# Altium schematic sheet RXMIX.SchDoc
size Legal; CompanyName: Brinton Engineering, LLC; Address1: 3479 Edison Way; Address2: Menlo Park CA 94025; Address3: +1 (877) 778-8435; Address4: brintonengineering.com; DocumentNumber: 48; Revision: 1; SheetNumber: 48; SheetTotal: 50
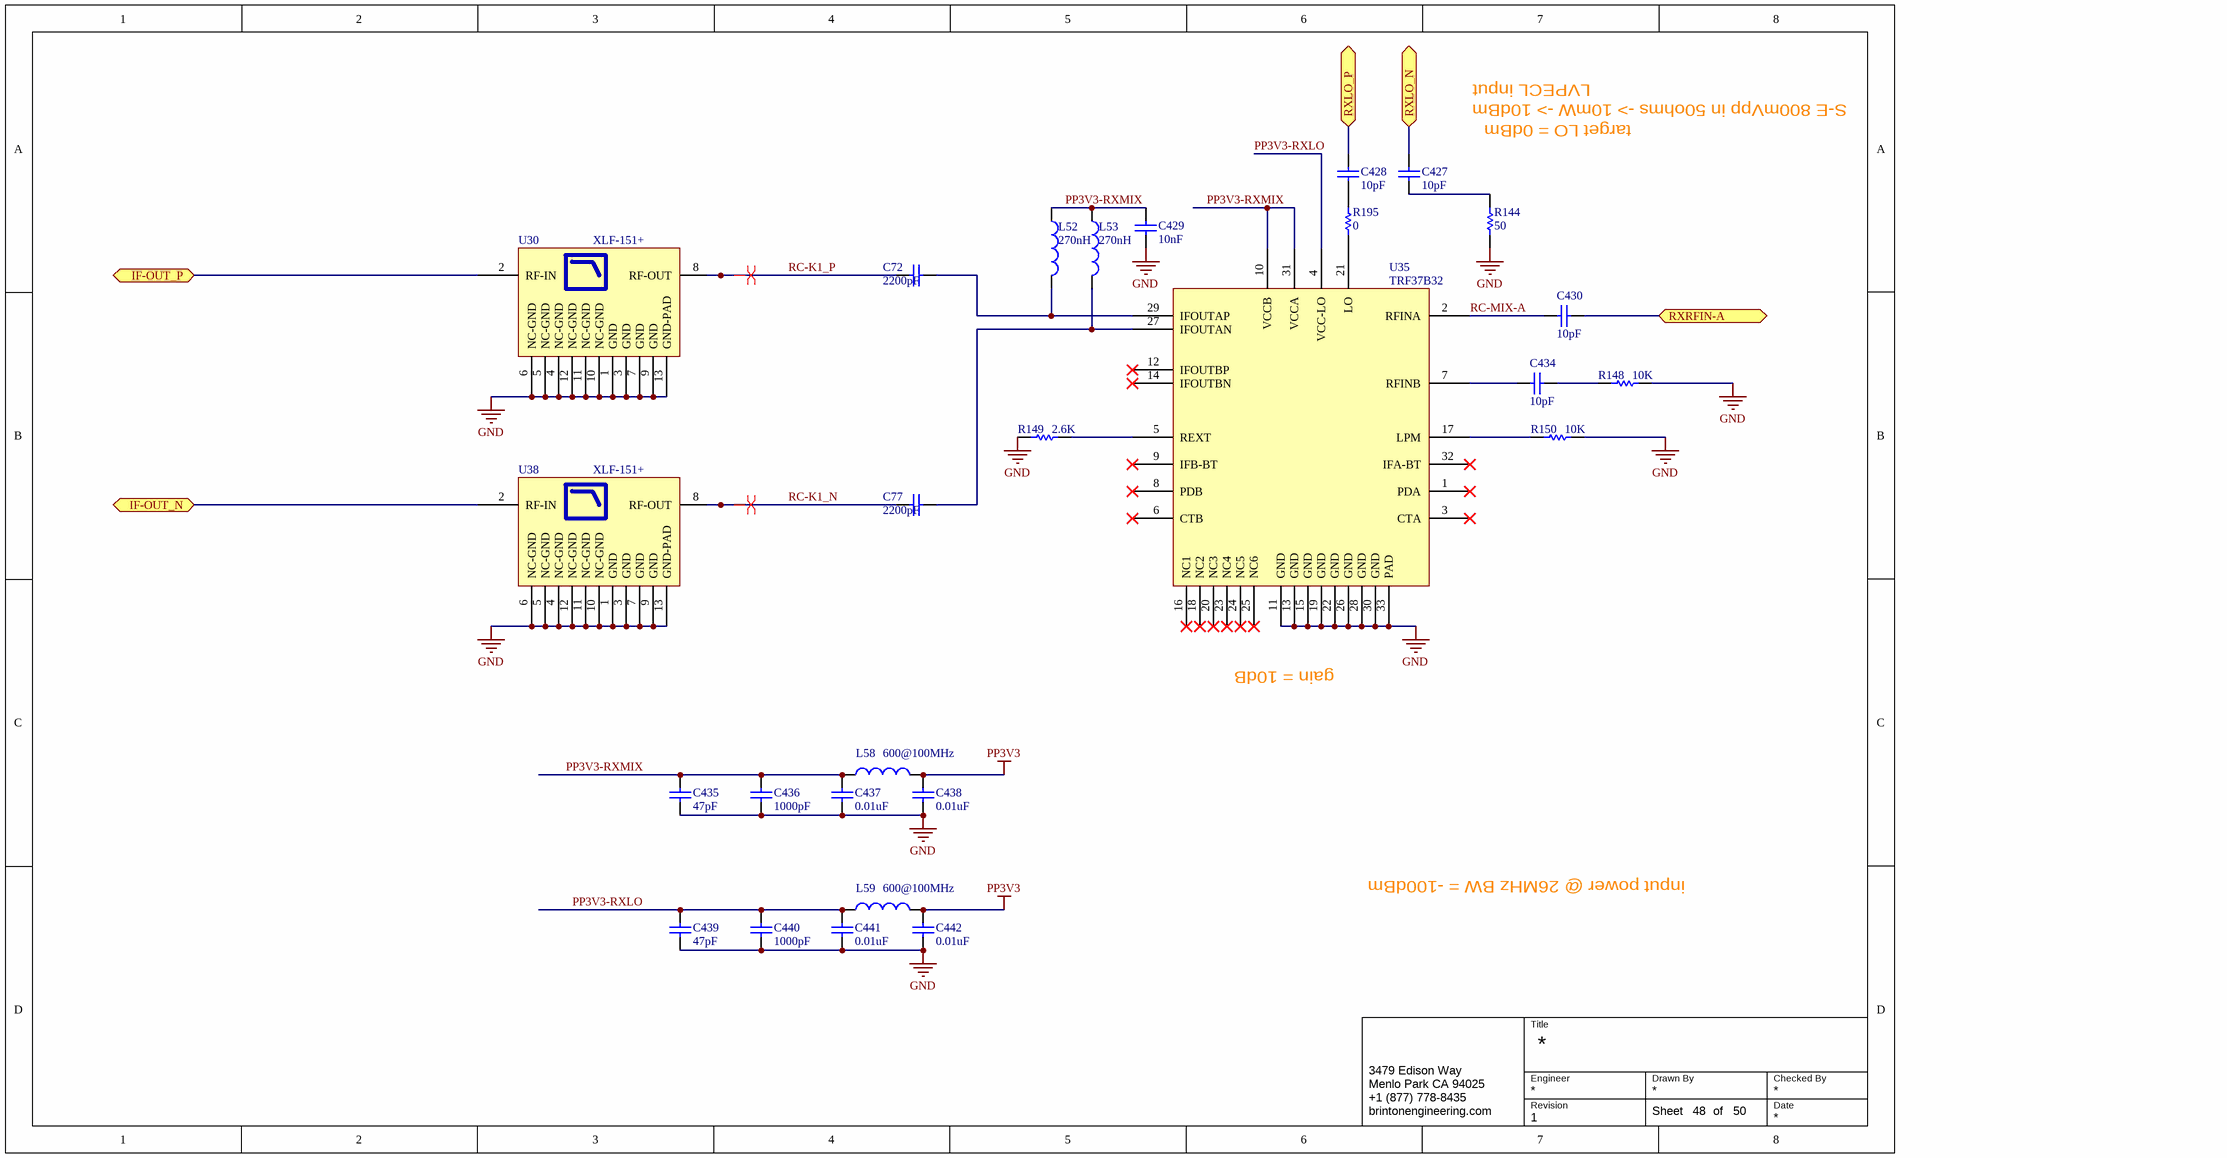
[diagram p0: RXMIX.SchDoc]

## Parts
C72  value 2200pF  [0402]  (hidden comment: CAP 0402)
C77  value 2200pF  [0402]  (hidden comment: CAP 0402)
C427  value 10pF  [0402]  (hidden comment: CAP 0402)
C428  value 10pF  [0402]  (hidden comment: CAP 0402)
C429  value 10nF  [0402]  (hidden comment: CAP 0402)
C430  value 10pF  [0402]  (hidden comment: CAP 0402)
C434  value 10pF  [0402]  (hidden comment: CAP 0402)
C435  value 47pF  [0402]  (hidden comment: CAP 0402)
C436  value 1000pF  [0402]  (hidden comment: CAP 0402)
C437  value 0.01uF  [0402]  (hidden comment: CAP 0402)
C438  value 0.01uF  [0402]  (hidden comment: CAP 0402)
C439  value 47pF  [0402]  (hidden comment: CAP 0402)
C440  value 1000pF  [0402]  (hidden comment: CAP 0402)
C441  value 0.01uF  [0402]  (hidden comment: CAP 0402)
C442  value 0.01uF  [0402]  (hidden comment: CAP 0402)
L52  value 270nH  [0603]  (hidden comment: IND 0603)
L53  value 270nH  [0603]  (hidden comment: IND 0603)
L58  value 600@100MHz  [0402]  (hidden comment: IND 0402)
L59  value 600@100MHz  [0402]  (hidden comment: IND 0402)
R144  value 50  [0402]  (hidden comment: RES 0402)
R148  value 10K  [0402]  (hidden comment: RES 0402)
R149  value 2.6K  [0402]  (hidden comment: RES 0402)
R150  value 10K  [0402]  (hidden comment: RES 0402)
R195  value 0  [0402]  (hidden comment: RES 0402)
U30  XLF-151+  [QFN-XLF-12]
U35  TRF37B32  [RTV-WQFN-32]
U38  XLF-151+  [QFN-XLF-12]

## Ports
IF-OUT_N, IF-OUT_P, RXLO_N, RXLO_P, RXRFIN-A

## Nets
GND: C429.1 C435.1 C436.1 C437.1 C438.1 C439.1 C440.1 C441.1 C442.1 R144.2 R148.1 R149.2 R150.1 U30.1(GND) U30.3(GND) U30.4(NC-GND) U30.5(NC-GND) U30.6(NC-GND) U30.7(GND) U30.9(GND) U30.10(NC-GND) U30.11(NC-GND) U30.12(NC-GND) U30.13(GND-PAD) U35.11(GND) U35.13(GND) U35.15(GND) U35.19(GND) U35.22(GND) U35.26(GND) U35.28(GND) U35.30(GND) U35.33(PAD) U38.1(GND) U38.3(GND) U38.4(NC-GND) U38.5(NC-GND) U38.6(NC-GND) U38.7(GND) U38.9(GND) U38.10(NC-GND) U38.11(NC-GND) U38.12(NC-GND) U38.13(GND-PAD)
PP3V3: C438.2 C442.2 L58.1 L59.1
IF-OUT_N: U38.2(RF-IN) ; port IF-OUT_N
IF-OUT_P: U30.2(RF-IN) ; port IF-OUT_P
PP3V3-RXLO: C439.2 C440.2 C441.2 L59.2 U35.4(VCC-LO)
PP3V3-RXMIX: C429.2 C435.2 C436.2 C437.2 L52.2 L53.2 L58.2 U35.10(VCCB) U35.31(VCCA)
RC-K1_N: C77.2 U38.8(RF-OUT)
RC-K1_P: C72.2 U30.8(RF-OUT)
RC-MIX-A: C430.2 U35.2(RFINA)
RXLO_N: C427.1 ; port RXLO_N
RXLO_P: C428.2 ; port RXLO_P
RXRFIN-A: C430.1 ; port RXRFIN-A
NetC72_1: C72.1 L52.1 U35.29(IFOUTAP)
NetC77_1: C77.1 L53.1 U35.27(IFOUTAN)
NetC427_2: C427.2 R144.1
NetC428_1: C428.1 R195.1
NetC434_1: C434.1 R148.2
NetC434_2: C434.2 U35.7(RFINB)
NetR149_1: R149.1 U35.5(REXT)
NetR150_2: R150.2 U35.17(LPM)
NetR195_2: R195.2 U35.21(LO)

Not connected (* = marked no-connect by the designer): U35 1(PDA)* 3(CTA)* 6(CTB)* 8(PDB)* 9(IFB-BT)* 12(IFOUTBP)* 14(IFOUTBN)* 16(NC1)* 18(NC2)* 20(NC3)* 23(NC4)* 24(NC5)* 25(NC6)* 32(IFA-BT)*

## Layout directives
differential pair: RC-K1_N, RC-K1_P

## Notes on the sheet
- LVPECL input
- S-E 800mVpp in 50ohms -> 10mW -> 10dBm
- target LO = 0dBm
- gain = 10dB
- input power @ 26MHz BW = -100dBm
- Title
- Engineer
- Revision
- Drawn By
- Checked By
- Date
- Sheet
- of

## Library data of the parts
C72 C77 = CAP 0402: Manufacturer: Kemet; Manufacturer P/N: C0402C222J3GACTU; Voltage: 50V; PCB Package: 0402
C427-C430 C434 = CAP 0402: Voltage: 16V; Manufacturer: *; Manufacturer P/N: *; PCB Package: 0402
C435 C439 = CAP 0402: Manufacturer: Kemet; Manufacturer P/N: CBR04C470F3GAC; Voltage: 25V; PCB Package: 0402
C436 C440 = CAP 0402: Manufacturer: Murata; Manufacturer P/N: GRM155R71H102KA01D; Voltage: 50V; PCB Package: 0402
C437 C438 C441 C442 = CAP 0402: Manufacturer: Murata; Manufacturer P/N: GRM155R71E103KA01D; Voltage: 25V; PCB Package: 0402
L52 L53 = IND 0603: Inductor; Manufacturer P/N: *; PCB Package: 0603
L58 L59 = IND 0402: Inductor; Manufacturer: Murata; Manufacturer P/N: BLM15PX601SN1D; PCB Package: 0402
R144 R148-R150 R195 = RES 0402: Resistor, SMD 0402; PCB Package: 0402; Manufacturer: *; Manufacturer P/N: *
  R144 R195: Do Not Place: *
U30 U38 = XLF-151+: Reflectionless Low-Pass Filter, DC-150Mhz; Manufacturer: Mini-Circuits; Manufacturer P/N: XLF-151+
U35 = TRF37B32: Dual Downmixer,  500-3300MHz with IF Amp; Manufacturer P/N: TRF37B32IRTVR; Manufacturer: Texas Instruments